# Altium schematic sheet CAN.SchDoc
size A4; SheetNumber: 3; SheetTotal: 3
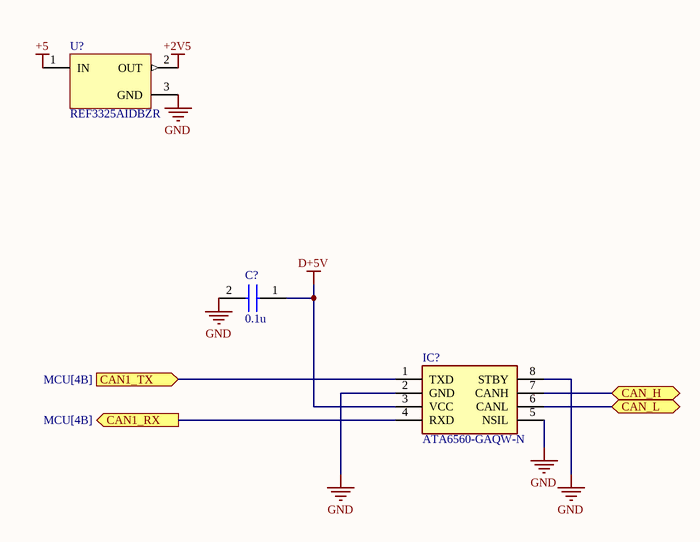
[diagram p0: CAN.SchDoc]

## Parts
C?  0.1u  [CAPC1608X90N]
IC?  ATA6560-GAQW-N  [SOIC127P600X175-8N]
U?  REF3325AIDBZR  [DBZ0003A_N]

## Ports
CAN1_RX (out, see MCU[4B]), CAN1_TX (in, see MCU[4B]), CAN_H (bidir), CAN_L (bidir)

## Nets
+2V5: U?.2(OUT)
+5: U?.1(IN)
D+5V: C?.1 IC?.3(VCC)
GND: C?.2 IC?.2(GND) IC?.5(NSIL) IC?.8(STBY) U?.3(GND)
CAN1_RX: IC?.4(RXD) ; port CAN1_RX
CAN1_TX: IC?.1(TXD) ; port CAN1_TX
CAN_H: IC?.7(CANH) ; port CAN_H
CAN_L: IC?.6(CANL) ; port CAN_L

## Library data of the parts
C? = CC0603KRX7R8BB104: Manufacturer_Name: KEMET; Datasheet Link: https://datasheet.datasheetarchive.com/originals/distributors/Datasheets_SAMA/d9f127a4875522309d99aa7dec79633c.pdf; Height: 0.9mm; Manufacturer_Part_Number: CC0603KRX7R8BB104; Mouser Part Number: 603-CC603KRX7R8BB104; Mouser Price/Stock: https://www.mouser.co.uk/ProductDetail/Yageo/CC0603KRX7R8BB104?qs=AgBp2OyFlx%252B4QOgEm%2Fb3YQ%3D%3D; Arrow Part Number: CC0603KRX7R8BB104; Arrow Price/Stock: https://www.arrow.com/en/products/cc0603krx7r8bb104/yageo
IC? = ATA6560-GAQW-N: Integrated Circuit; Manufacturer_Name: Microchip; Datasheet Link: https://mouser.componentsearchengine.com/Datasheets/1/ATA6560-GAQW-N.pdf; Height: 1.75mm; Manufacturer_Part_Number: ATA6560-GAQW-N; Mouser Part Number: 579-ATA6560-GAQW-N; Mouser Price/Stock: https://www.mouser.co.uk/ProductDetail/Microchip-Technology-Atmel/ATA6560-GAQW-N?qs=y6ZabgHbY%252By0WOzqKXUktg%3D%3D; Arrow Part Number: ATA6560-GAQW-N; Arrow Price/Stock: https://www.arrow.com/en/products/ata6560-gaqw-n/microchip-technology?region=nac
U? = CMP-0367-00131-2: 30 ppm / degC Drift, 3.9 uA Voltage Reference, -40 to 125 degC, 3-pin SOT-23 (DBZ), Green (RoHS & no Sb/Br); Manufacturer: Texas Instruments; Temp Coeff(Max)(ppm/ degree C): 30; Initial Accuracy @ 25/deg C(%): 0.15; Rating: Catalog; VI(Max)(V): 5.5; Iout/Iz(Max)(mA): 5; VO(V): 2.5; VI(Min)(V): 2.66; SubFamily: Series Voltage Reference; Temp Coeff(Typ)(ppm/ degree C): 8; ComponentLink1Description: Manufacturer URL; PackageReference: DBZ0003A; ComponentLink3Description: Package Specification; PartNumber: REF3325AIDBZR; PackageVersion: 4203227/B; DatasheetVersion: SBOS392A; PackageDescription: 3-Pin Plastic Small Outline, Body 2.92 x 1.3 mm, Pitch 0.95 mm; Eco-Plan: Green (RoHS & no Sb/Br); ComponentLink2Description: Datasheet; ComponentLink3URL: http://www.ti.com/litv/pdf/mpds108a; ComponentLink2URL: http://www.ti.com/general/docs/lit/getliterature.tsp?genericPartNumber=REF3325&fileType=pdf; Iq(Max)(uA): 5; Mounting Technology: Surface Mount; ComponentLink1URL: http://www.ti.com/; Code_JEDEC: TO-236